# EAGLE design line+kick (EAGLE 9.4.0)
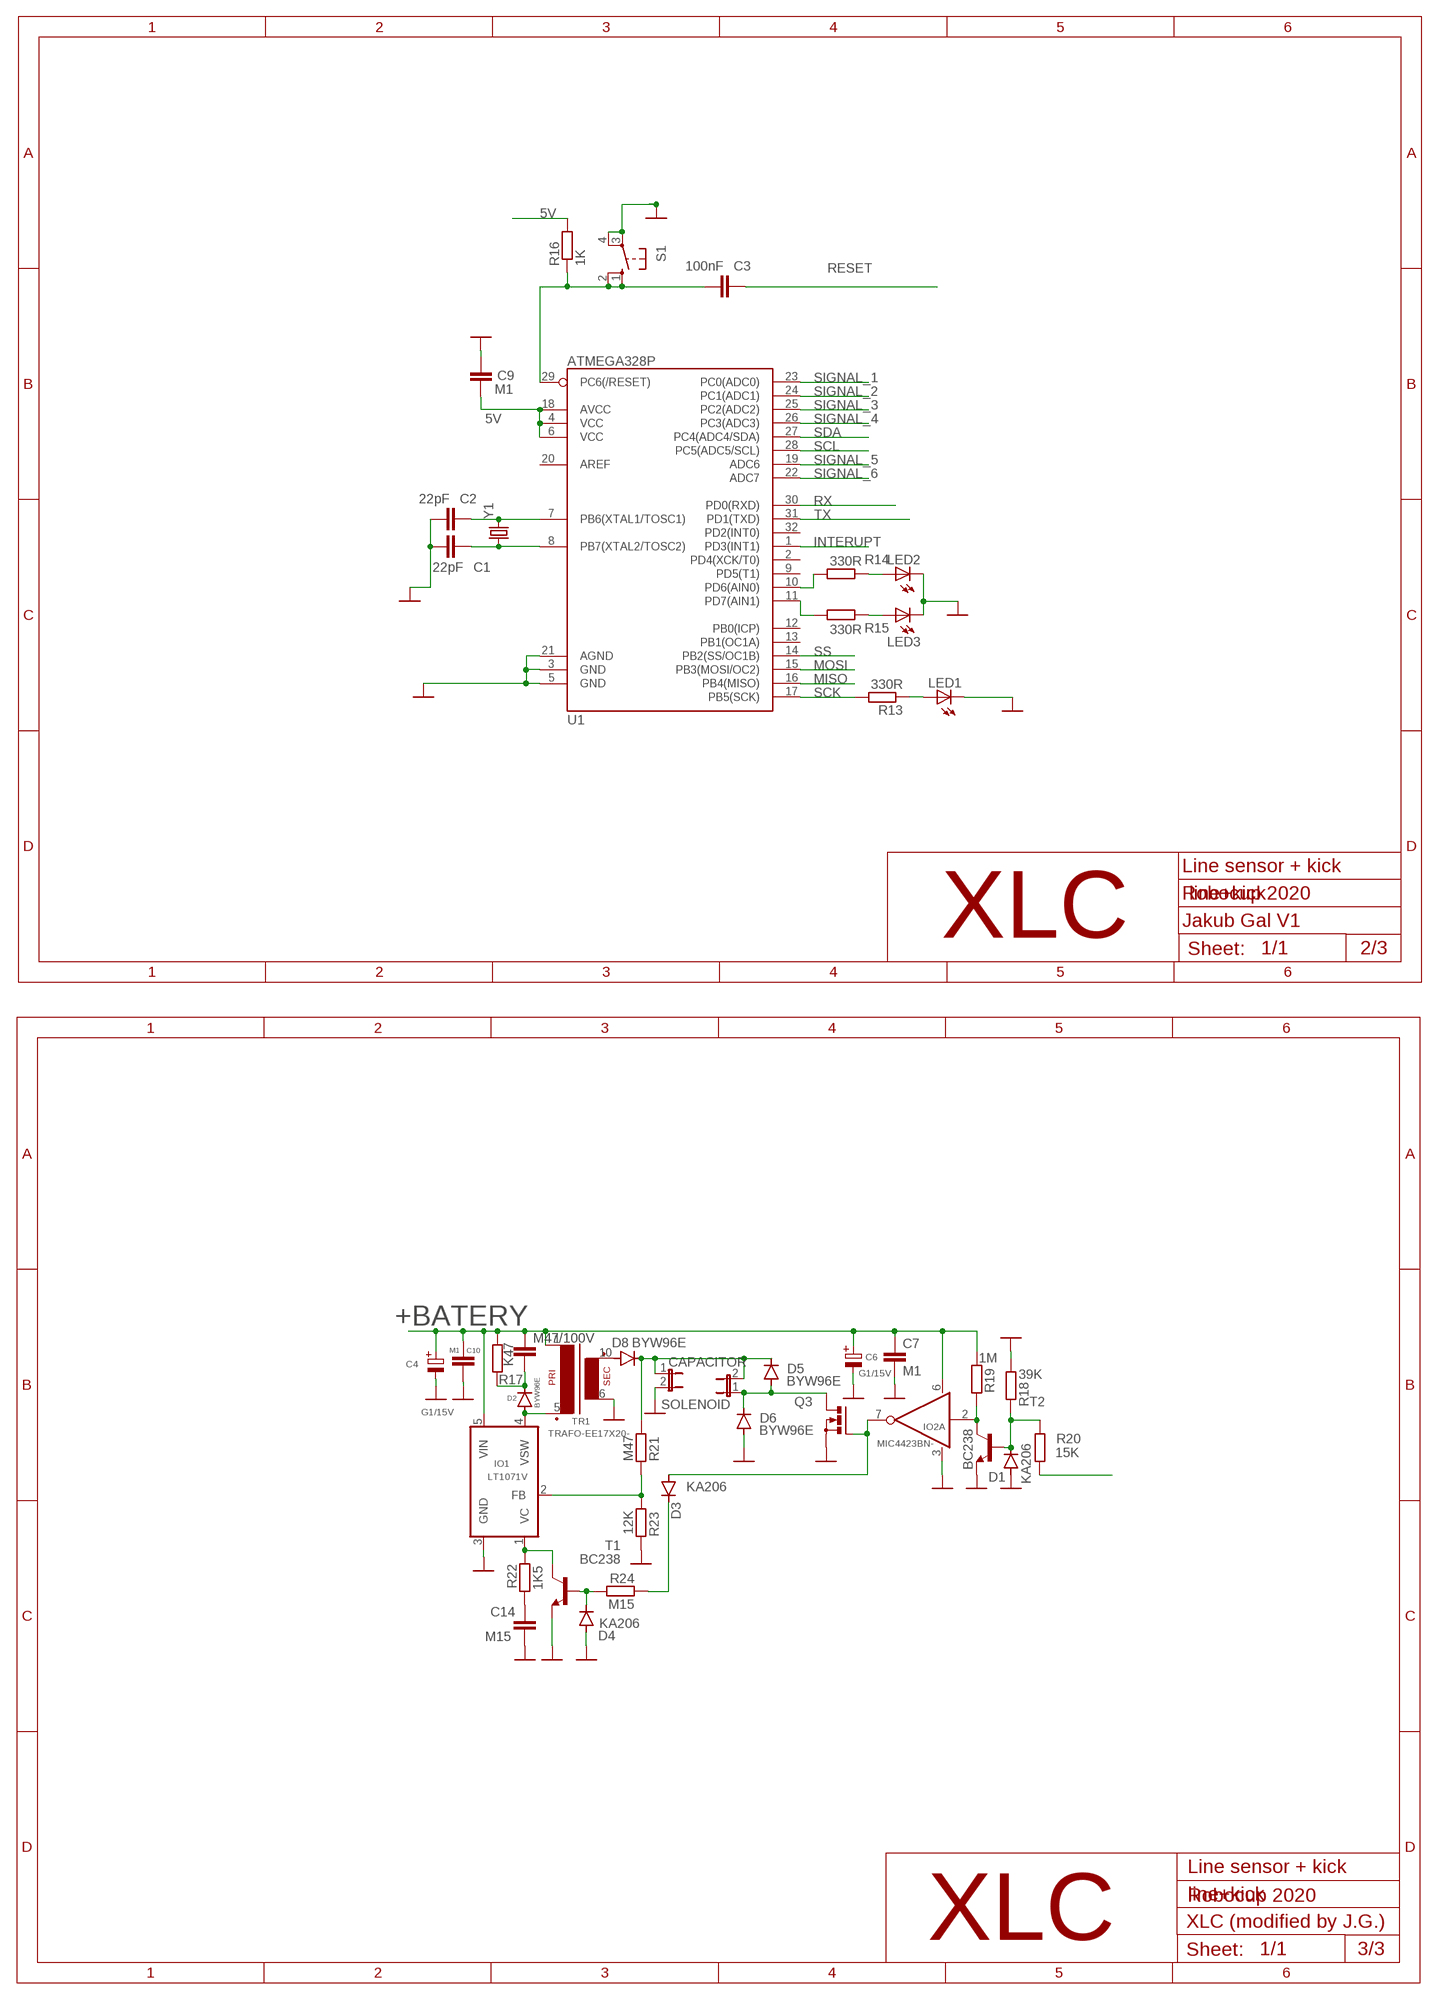
[diagram p0: schematic, sheet 1, part 1 of 2]
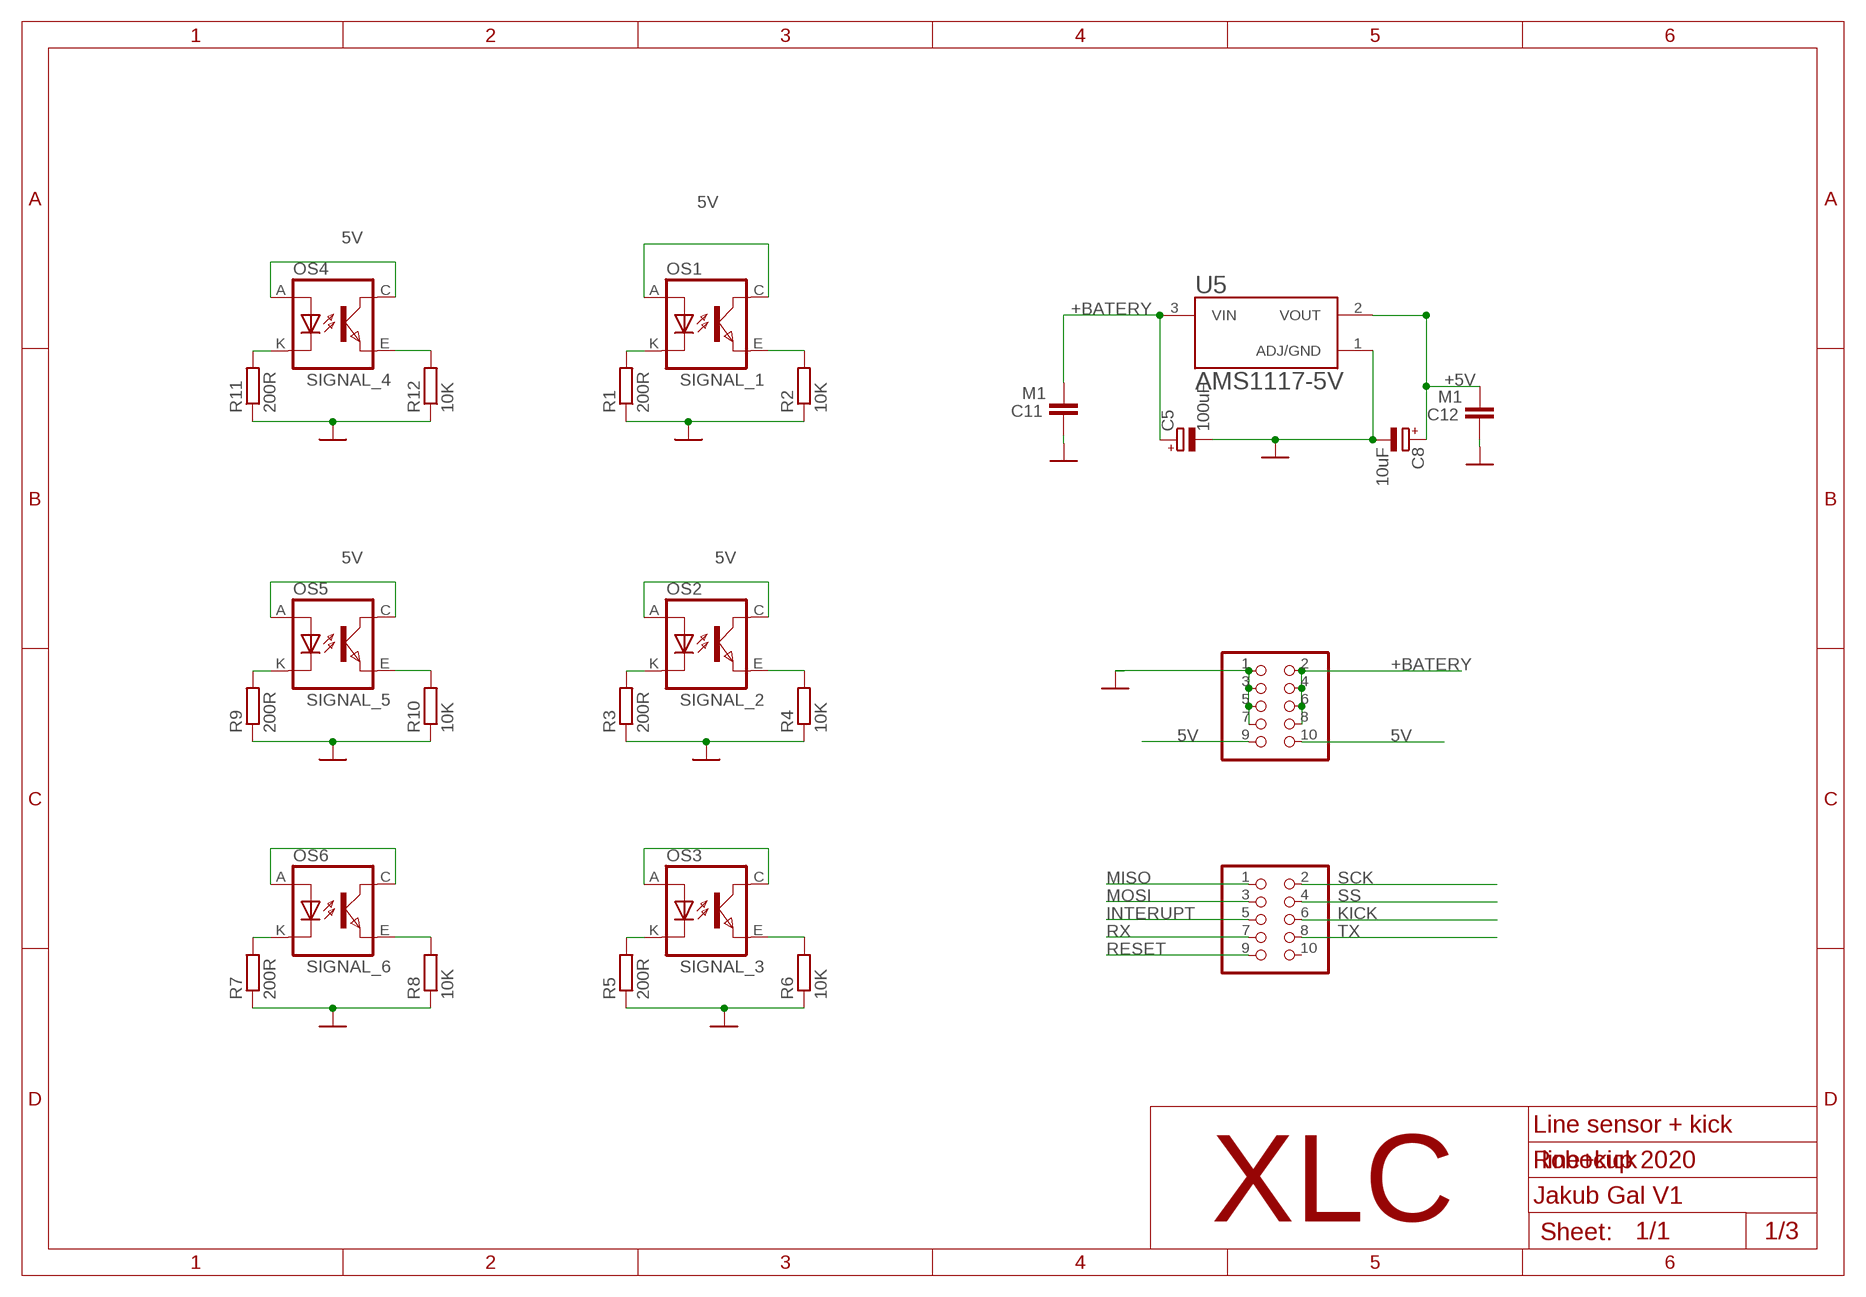
[diagram p1: schematic, sheet 1, part 2 of 2]

## Parts
C1  22pF  C-EUC0603  [C0603]
C2  22pF  C-EUC0603  [C0603]
C3  100nF  C-EUC0603  [C0603]
C4  G1/15V  KOND-ELEKT-2,5/7  [E-2,5/7-RAD]
C5  100uF  CPOL-EUUD-6,3X7,7  [UD-6,3X7,7_NICHICON]
C6  G1/15V  KOND-ELEKT-2,5/7  [E-2,5/7-RAD]
C7  M1  C-EUC0805K  [C0805K]
C8  10uF  CPOL-EUUD-4X5,8  [UD-4X5,8_NICHICON]
C9  M1  C-EUC0603  [C0603]
C10  M1  C-EUC0805K  [C0805K]
C11  M1  C-EUC0603  [C0603]
C12  M1  C-EUC0603  [C0603]
C14  M15  C-EUC0805K  [C0805K]
CAPACITOR  JP1E  [JP1]
D1  KA206  DIODE-D-7.5  [D-7.5]
D2  BYW96E  BYW96  [SOD64-10]
D3  KA206  DIODE-D-7.5  [D-7.5]
D4  KA206  DIODE-D-7.5  [D-7.5]
D5  BYW96E  BYW96  [SOD64-10]
D6  BYW96E  BYW96  [SOD64-10]
D8  BYW96E  BYW96  [SOD64-10]
IO1  LT1071V  [TO-220-5P]
IO2  MIC4423BN-  [DIL8]
JP2  PINHD-2X5  [2X05]
JP3  PINHD-2X5  [2X05]
LED1  LEDCHIPLED_0603  [CHIPLED_0603]
LED2  LEDCHIPLED_0603  [CHIPLED_0603]
LED3  LEDCHIPLED_0603  [CHIPLED_0603]
M47/100V  C-EUC0805K  [C0805K]
OS1  TCRT5000  [TCRT5000]
OS2  TCRT5000  [TCRT5000]
OS3  TCRT5000  [TCRT5000]
OS4  TCRT5000  [TCRT5000]
OS5  TCRT5000  [TCRT5000]
OS6  TCRT5000  [TCRT5000]
Q3  PMOSFET_NTO220BV  [TO220BV]
R1  200R  R-EU_R0603  [R0603]
R2  10K  R-EU_R0603  [R0603]
R3  200R  R-EU_R0603  [R0603]
R4  10K  R-EU_R0603  [R0603]
R5  200R  R-EU_R0603  [R0603]
R6  10K  R-EU_R0603  [R0603]
R7  200R  R-EU_R0603  [R0603]
R8  10K  R-EU_R0603  [R0603]
R9  200R  R-EU_R0603  [R0603]
R10  10K  R-EU_R0603  [R0603]
R11  200R  R-EU_R0603  [R0603]
R12  10K  R-EU_R0603  [R0603]
R13  330R  R-EU_R0603  [R0603]
R14  330R  R-EU_R0603  [R0603]
R15  330R  R-EU_R0603  [R0603]
R16  1K  R-EU_R0603  [R0603]
R17  K47  R-EU_R0603  [R0603]
R18  39K  R-EU_R0603  [R0603]
R19  1M  R-EU_R0603  [R0603]
R20  15K  R-EU_R0603  [R0603]
R21  M47  R-EU_R0603  [R0603]
R22  1K5  R-EU_R0603  [R0603]
R23  12K  R-EU_R0603  [R0603]
R24  M15  R-EU_R0603  [R0603]
S1  10-XX  [B3F-10XX]
SOLENOID  JP1E  [JP1]
T1  BC238  [TO92]
T2  BC238  [TO92]
TR1  TRAFO-EE17X20-  [TRAFO-EE17X20]
U1  ATMEGA328P  ATMEGA328_SMT  [TQFP32-08]
U5  AMS1117-5V  AMS1117-3.3  [SOT229P700X180-4N]
Y1  CRYSTALHC49US  [HC49US]

## Nets
5V: C9.1 JP3.9 JP3.10 OS1.A(ANODE) OS1.C(COLLECTOR) OS2.A(ANODE) OS2.C(COLLECTOR) OS3.A(ANODE) OS3.C(COLLECTOR) OS4.A(ANODE) OS4.C(COLLECTOR) OS5.A(ANODE) OS5.C(COLLECTOR) OS6.A(ANODE) OS6.C(COLLECTOR) R16.2 U1.4(VCC) U1.6(VCC) U1.18(AVCC)
+5V: C8.+ C12.1 U5.2(VOUT)
+BATERY: C4.+ C5.+ C6.+ C7.1 C10.1 C11.1 IO1.5(VIN) IO2.6(G:VCC) JP3.2 JP3.4 JP3.6 JP3.8 M47/100V.1 R17.1 R19.2 TR1.1 U5.3(VIN)
GND: C1.1 C2.1 C4.- C5.- C6.- C7.2 C8.- C9.2 C10.2 C11.2 C12.2 C14.2 CAPACITOR.2 D1.A D4.A D6.A IO1.3(GND) IO2.3(G:GND) JP3.1 JP3.3 JP3.5 JP3.7 LED1.C LED2.C LED3.C Q3.S R1.1 R2.1 R3.1 R4.1 R5.1 R6.1 R7.1 R8.1 R9.1 R10.1 R11.1 R12.1 R18.2 R23.1 S1.3(P) S1.4(P1) T1.1(E) T2.1(E) TR1.6 U1.3(GND) U1.5(GND) U1.21(AGND) U5.1(ADJ/GND)
INTERUPT: JP2.5 U1.1(PD3(INT1))
KICK: JP2.6 R20.1
MISO: JP2.1 U1.16(PB4(MISO))
MOSI: JP2.3 U1.15(PB3(MOSI/OC2))
N$1: OS1.K(CATHODE) R1.2
N$2: OS2.K(CATHODE) R3.2
N$3: OS3.K(CATHODE) R5.2
N$4: OS6.K(CATHODE) R7.2
N$5: OS5.K(CATHODE) R9.2
N$6: OS4.K(CATHODE) R11.2
N$7: C2.2 U1.7(PB6(XTAL1/TOSC1)) Y1.2
N$8: C1.2 U1.8(PB7(XTAL2/TOSC2)) Y1.1
N$9: IO1.1(VC) R22.1 T1.3(C)
N$10: C14.1 R22.2
N$11: D8.A TR1.10
N$13: CAPACITOR.1 D5.C D8.C R21.2 SOLENOID.2
N$14: IO1.2(FB) R21.1 R23.2
N$15: D4.C R24.2 T1.2(B)
N$16: C3.1 R16.1 S1.1(S) S1.2(S1) U1.29(PC6(/RESET))
N$17: LED1.A R13.1
N$18: IO2.2(A:I) R19.1 T2.3(C)
N$19: LED2.A R14.1
N$20: R15.2 U1.11(PD7(AIN1))
N$21: LED3.A R15.1
N$22: R14.2 U1.10(PD6(AIN0))
N$23: D2.A IO1.4(VSW) TR1.5
N$24: D2.C M47/100V.2 R17.2
N$25: D3.A IO2.7(A:O) Q3.G
N$26: D5.A D6.C Q3.D SOLENOID.1
N$29: D3.C R24.1
N$31: D1.C R18.1 R20.2 T2.2(B)
RESET: C3.2 JP2.9
RX: JP2.7 U1.30(PD0(RXD))
SCK: JP2.2 R13.2 U1.17(PB5(SCK))
SCL: U1.28(PC5(ADC5/SCL))
SDA: U1.27(PC4(ADC4/SDA))
SIGNAL_1: OS1.E(EMITTER) R2.2 U1.23(PC0(ADC0))
SIGNAL_2: OS2.E(EMITTER) R4.2 U1.24(PC1(ADC1))
SIGNAL_3: OS3.E(EMITTER) R6.2 U1.25(PC2(ADC2))
SIGNAL_4: OS4.E(EMITTER) R12.2 U1.26(PC3(ADC3))
SIGNAL_5: OS5.E(EMITTER) R10.2 U1.19(ADC6)
SIGNAL_6: OS6.E(EMITTER) R8.2 U1.22(ADC7)
SS: JP2.4 U1.14(PB2(SS/OC1B))
TX: JP2.8 U1.31(PD1(TXD))
Unconnected: IO2.4(B:I) IO2.5(B:O) JP2.10 U1.2(PD4(XCK/T0)) U1.9(PD5(T1)) U1.12(PB0(ICP)) U1.13(PB1(OC1A)) U1.20(AREF) U1.32(PD2(INT0))

## Notes on the sheet
- Line sensor + kick
- Robocup 2020
- Jakub Gal V1
- XLC
- 2/3
- Line sensor + kick
- Robocup 2020
- XLC (modified by J.G.)
- XLC
- 3/3
- Line sensor + kick
- Robocup 2020
- Jakub Gal V1
- XLC
- 1/3

## Library data of the parts
C1-C3 C9 C11 C12 = rcl:C-EU: CAPACITOR, European symbol
C4 C6 = TABOR K1:KOND-ELEKT: Kondenzátor elektrolyticky
C5 C8 = rcl:CPOL-EU: POLARIZED CAPACITOR, European symbol; SPICEPREFIX: C
C7 C10 C14 M47/100V = resistor:C-EU: CAPACITOR, European symbol
CAPACITOR SOLENOID = jumper:JP1E: JUMPER
D1 D3 D4 = diode:DIODE-: DIODE
D2 D5 D6 D8 = diode:BYW96: DIODE fast soft-recovery rectifier
IO1 = TABOR K1:LT1071: DC/DC pulzný IO
IO2 = TABOR K1:MIC4423BN: Dvojity invertor - budic FET tranzistorov
JP2 JP3 = pinhead:PINHD-2X5: PIN HEADER
LED1-LED3 = audio amplifier example:LED
OS1-OS3 OS5 = tcrt5000:TCRT5000
OS4 OS6 = tcrt5000:TCRT5000; SPICEPREFIX: O
Q3 = transistor-power:PMOSFET_N: Power MOSFET N-Channel
R1-R16 = rcl:R-EU_: RESISTOR, European symbol; SPICEPREFIX: R
R17-R24 = resistor:R-EU_: RESISTOR, European symbol
S1 = switch-omron:10-XX: OMRON SWITCH; MPN: B3F-1000; OC_FARNELL: 176432; OC_NEWARK: 36M3542
T1 T2 = transistor:BC238: NPN TRANSISTOR
TR1 = TABOR K1:TRAFO-EE17X20: Trafo na ferite EE17x20 - 1 primar, 1 sekundar
U1 = SparkFun-DigitalIC:ATMEGA328_SMT: 32-Pin Atmega328 part Commonly used on Arduino compatible boards Available in QFP and QFN packages TQFP is IC-09069 QFN is non-stock; PROD_ID: IC-09069
U5 = AMS1117-3.3:AMS1117-3.3: Sot223/Pkg 1-Amp 3.3-Volt Low Drop Out Voltage Regulatator; AVAILABILITY: Unavailable; DESCRIPTION: Sot223/Pkg 1-Amp 3.3-Volt Low Drop Out Voltage Regulatator; MF: Advanced Monolithic Systems; MP: AMS1117-3.3; PACKAGE: None; PRICE: None
Y1 = SparkFun-FreqCtrl:CRYSTAL: Various standard crystals. Proven footprints. Spark Fun Electronics SKU : COM-00534

## Board
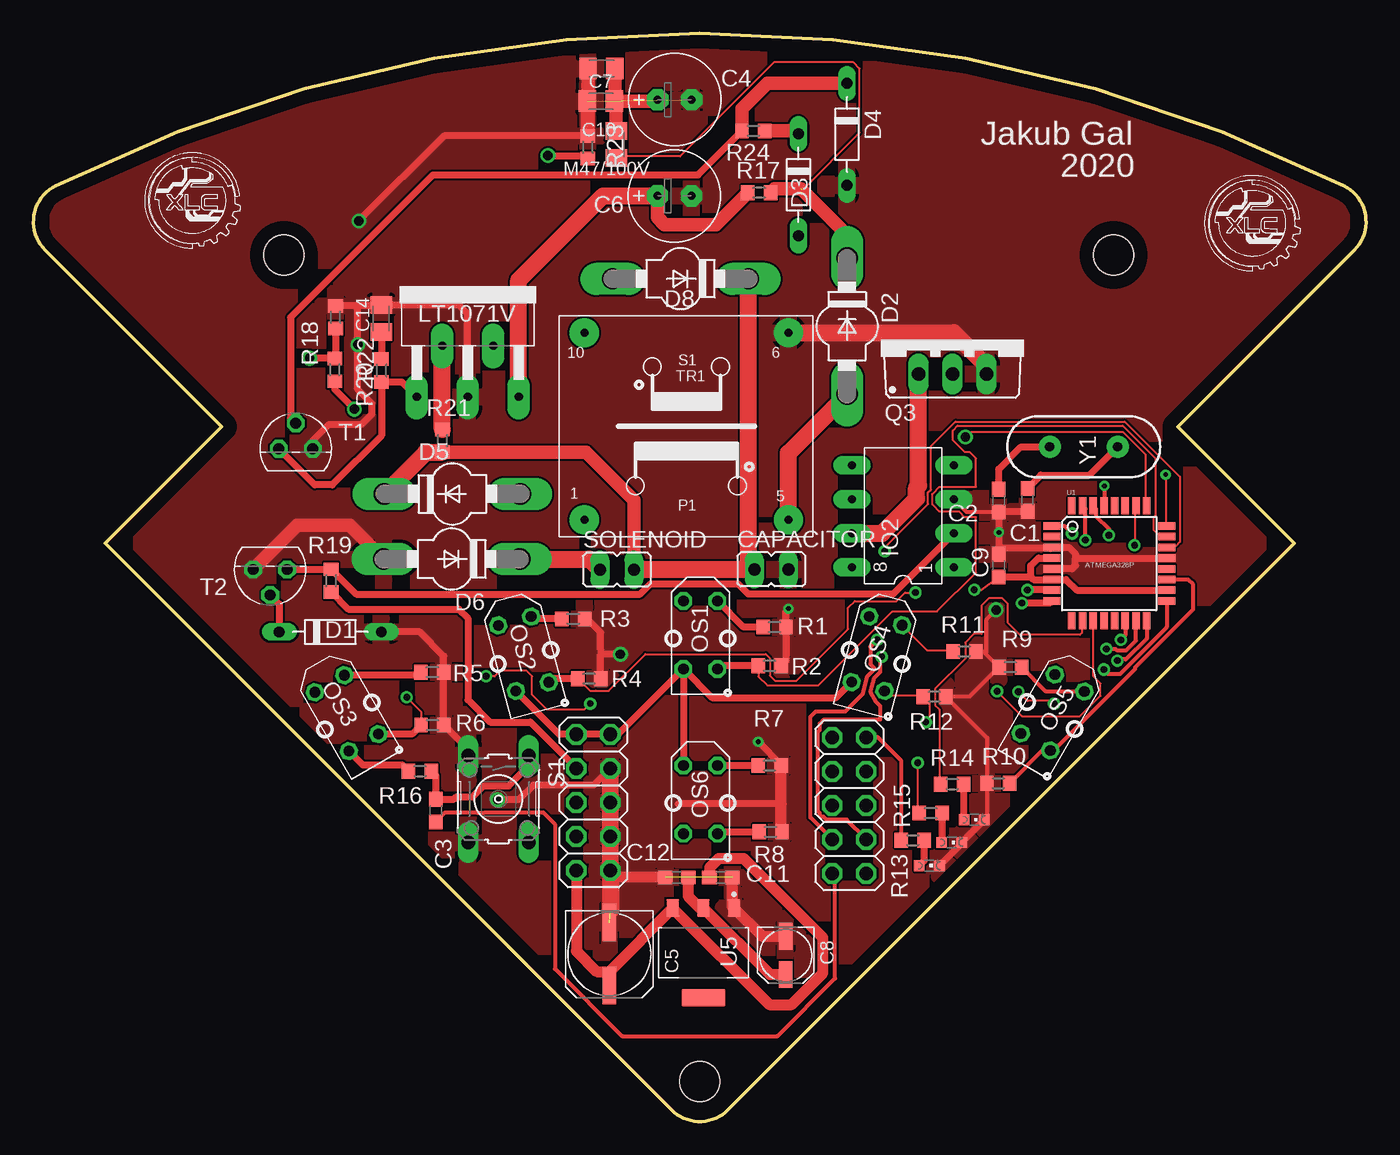
[diagram p2: board, top side]
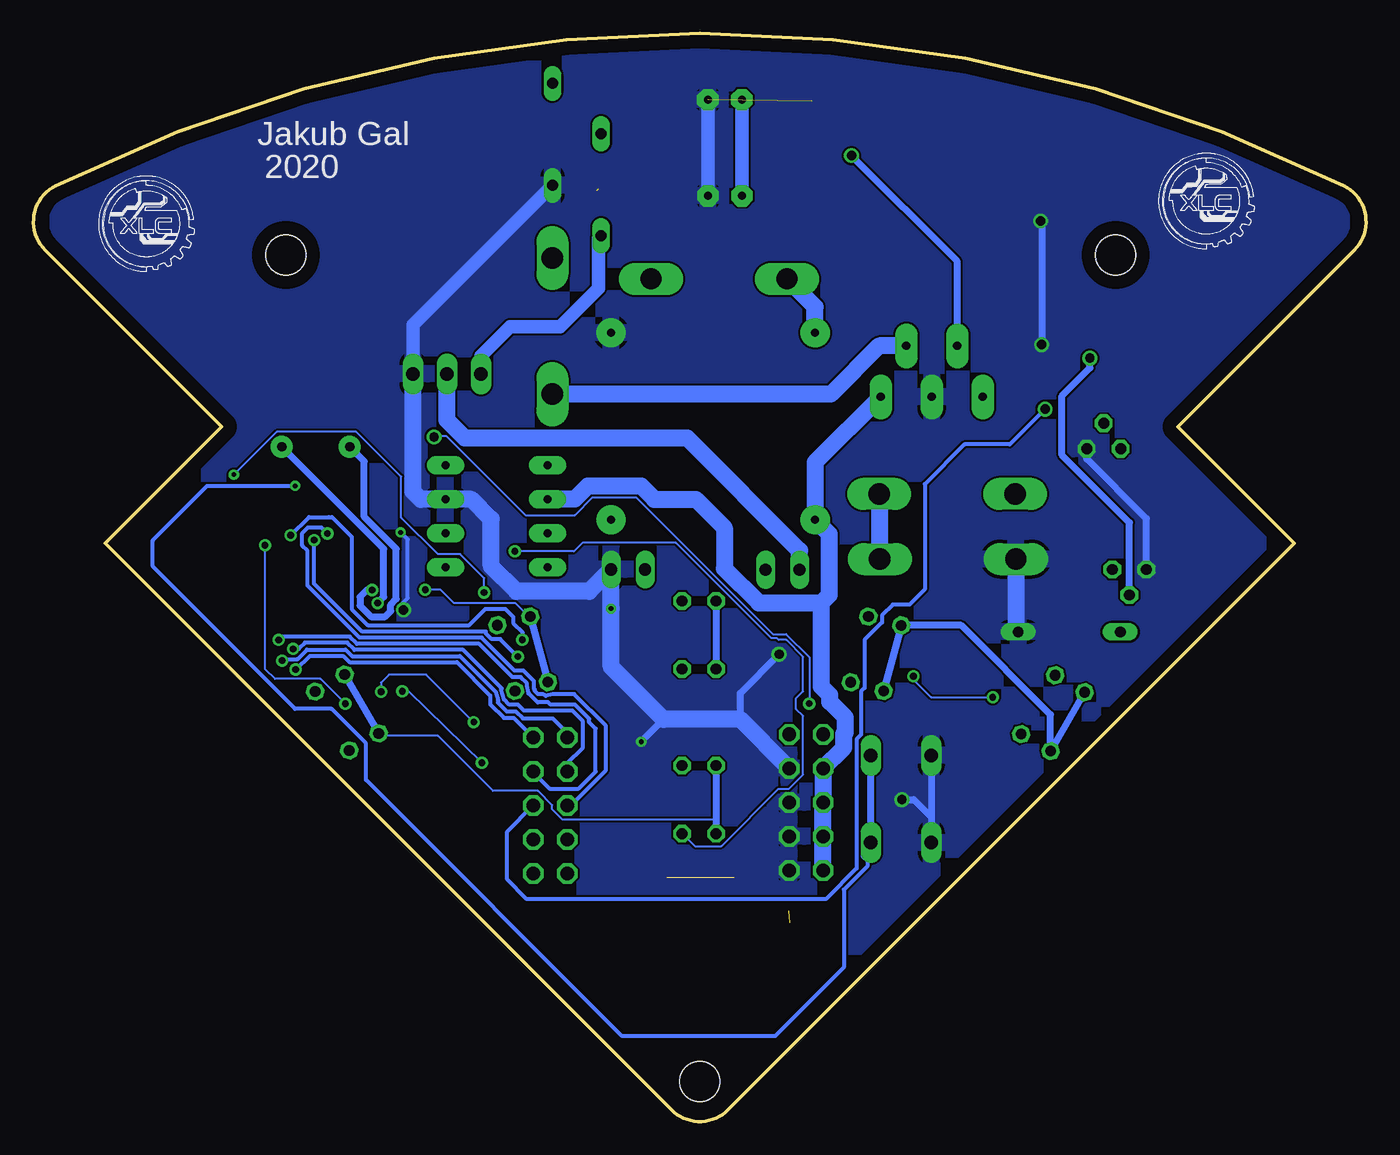
[diagram p3: board, bottom side, seen from below]

Size 99.55 x 81.25 mm. Coordinates in mm from the lower left corner, seen from the top.
Outline: 85.49,51.89 98.67,65.08 arc108 97.9,69.88 arc53 1.66,69.88 arc108 0.88,65.08 14.07,51.89 5.35,43.18 47.66,0.87 arc90 51.9,0.87 94.2,43.18 85.49,51.89
Copper layers (1*16): Top 0.035mm / dielectric 1.5mm / Bottom 0.035mm
Design rules "default": minimum track width 6mil, minimum drill 0.35mm, track to track 6mil, track to pad 6mil, pad to pad 6mil, via to via 6mil, smd to smd 6mil, copper to edge 40mil, drill to drill 6mil, minimum pad ring 10mil, minimum via ring 8mil, stop-mask expansion 4mil, vias tented up to drill 0mil, thermal gap 10mil
Holes 3 mm at 49.78,3 18.71,64.71 80.71,64.71

### Footprints (pad centres in the part's own frame; a part is rotated, then mirrored left to right if it is on the bottom)
C0603 = smd 1.1 x 1: 1 -0.85,0; 2 0.85,0
E-2,5/7-RAD = drill 0.61 pad 1.6 octagon: + -1.27,0; - 1.27,0
UD-6,3X7,7_NICHICON = smd 2.8 x 1: + 2.35,0; - -2.35,0
C0805K = smd 1.3 x 1.6: 1 -1,0; 2 1,0
UD-4X5,8_NICHICON = smd 2 x 1: + 1.425,0; - -1.425,0
JP1 = drill 0.914 long: 1 0,-1.27; 2 0,1.27
D-7.5 = drill 0.813 long: A 3.81,0; C -3.81,0
SOD64-10 = drill 1.6 long: A 5.08,0; C -5.08,0
TO-220-5P = drill 0.61 pad 1.676 long: 1 -3.81,0; 2 -1.905,3.81; 3 0,0; 4 1.905,3.81; 5 3.81,0
DIL8 = drill 0.61 pad 1.4 long: 1 -3.81,-3.81; 2 -1.27,-3.81; 3 1.27,-3.81; 4 3.81,-3.81; 5 3.81,3.81; 6 1.27,3.81; 7 -1.27,3.81; 8 -3.81,3.81
2X05 = drill 1.016 octagon: 1 -5.08,-1.27; 2 -5.08,1.27; 3 -2.54,-1.27; 4 -2.54,1.27; 5 0,-1.27; 6 0,1.27; 7 2.54,-1.27; 8 2.54,1.27; 9 5.08,-1.27; 10 5.08,1.27
CHIPLED_0603 = smd 0.8 x 0.8: A 0,-0.75; C 0,0.75
TCRT5000 = drill 0.8 octagon: A -2.54,-1.27; C 2.54,-1.27; E 2.54,1.27; K -2.54,1.27
TO220BV = drill 1.016 long: D 0,-2.54; G -2.54,-2.54; S 2.54,-2.54
R0603 = smd 1 x 1.1: 1 -0.85,0; 2 0.85,0
B3F-10XX = drill 1.016 long: 1 -3.251,2.261; 2 3.251,2.261; 3 -3.251,-2.261; 4 3.251,-2.261
TO92 = drill 0.813 octagon: 1 1.27,0; 2 0,1.905; 3 -1.27,0
TRAFO-EE17X20 = drill 0.61 pad 2.184: 1 -7.62,-7.62; 5 7.62,-7.62; 6 7.62,6.35; 10 -7.62,6.35
TQFP32-08 = smd 1.27 x 0.559: 1 -4.293,2.8; 2 -4.293,2; 3 -4.293,1.2; 4 -4.293,0.4; 5 -4.293,-0.4; 6 -4.293,-1.2; 7 -4.293,-2; 8 -4.293,-2.8; 17 4.293,-2.8; 18 4.293,-2; 19 4.293,-1.2; 20 4.293,-0.4; 21 4.293,0.4; 22 4.293,1.2; 23 4.293,2; 24 4.293,2.8 | smd 0.559 x 1.27: 9 -2.8,-4.293; 10 -2,-4.293; 11 -1.2,-4.293; 12 -0.4,-4.293; 13 0.4,-4.293; 14 1.2,-4.293; 15 2,-4.293; 16 2.8,-4.293; 25 2.8,4.293; 26 2,4.293; 27 1.2,4.293; 28 0.4,4.293; 29 -0.4,4.293; 30 -1.2,4.293; 31 -2,4.293; 32 -2.8,4.293
SOT229P700X180-4N = smd 0.93 x 1.31: 1 -2.29,-3.345; 2 0,-3.345; 3 2.29,-3.345 | smd 3.24 x 1.31: 4 0,3.345
HC49US = drill 0.7 pad 1.651: 1 -2.54,0; 2 2.54,0

### Placement (x,y rotation side)
C1  74.26,46.42 90 top
C2  72.12,46.37 90 top
C3  30.05,23.22 270 top
C4  47.9,76.31 0 top
C5  43.02,12.5 270 top
C6  47.89,69.13 0 top
C7  42.38,76.21 180 top
C8  56.2,12.41 270 top
C9  72.11,41.52 90 top
C10  42.43,78.64 180 top
C11  51.36,18.23 0 top
C12  48.06,18.24 180 top
C14  25.98,59.97 90 top
CAPACITOR  55.13,41.23 270 top
D1  22.18,36.56 0 top
D2  60.78,59.4 270 top
D3  57.15,69.96 270 top
D4  60.78,73.72 270 top
D5  31.3,46.88 0 top
D6  31.24,42 180 top
D8  48.34,62.94 180 top
IO1  32.45,54.12 0 top
IO2  64.96,45.2 90 top
JP2  60.95,23.61 270 top
JP3  41.83,23.84 90 top
LED1  66.93,19.11 270 top
LED2  70.28,22.54 270 top
LED3  68.6,20.84 270 top
M47/100V  43.53,72.97 270 top
OS1  49.83,36.34 270 top
OS2  36.61,34.93 285 top
OS3  23.4,30.5 300 top
OS4  63.01,34.94 255 top
OS5  76.13,30.54 240 top
OS6  49.83,24.04 270 top
Q3  68.66,58.37 0 top
R1  55.37,36.93 180 top
R2  55,34.04 180 top
R3  40.33,37.54 180 top
R4  41.52,33.07 180 top
R5  29.8,33.56 180 top
R6  29.81,29.61 180 top
R7  55,26.58 180 top
R8  55.07,21.64 180 top
R9  72.98,33.93 0 top
R10  72.08,25.26 0 top
R11  69.56,35.11 180 top
R12  67.32,31.73 180 top
R13  65.69,21 180 top
R14  68.64,25.19 180 top
R15  67.03,23.04 180 top
R16  28.87,26.16 180 top
R17  54.22,69.37 0 top
R18  22.57,60.07 90 top
R19  22.24,40.4 270 top
R20  22.51,56.14 90 top
R21  30.55,50.84 270 top
R22  26,56.09 90 top
R23  41.42,72.76 270 top
R24  53.78,73.98 180 top
S1  34.74,24.09 270 top
SOLENOID  43.59,41.21 270 top
T1  19.6,50.24 0 top
T2  17.68,41.23 180 top
TR1  48.78,52.56 0 top
U1  80.37,41.68 0 top
U5  50.05,12.6 180 top
Y1  78.46,50.39 180 top

### Tracks (layer width: path | path; a pad name or v marks a point on that pad's centre or on a via)
5V  (via drill 0.5)
  Top 0.152: v70.28,39.7 70.81,39.7 C9.1
  Top 0.508: OS4.C 59.97,31.66 50.7,31.66 OS1.C | OS1.C OS6.A | OS1.C 43.68,28.92 JP3.9 JP3.10 39.27,28.92 OS2.C | OS3.C 24.6,26.63 27.55,26.63 R16.2 | C9.1 74.51,40.67 | 74.51,40.67 74.71,40.46 76.06,40.46 U1.6 77.13,40.48 77.93,39.68 U1.18 | 74.51,40.67 74.51,41.51 75.08,42.08 U1.4
  Bottom 0.152: v70.28,39.7 69.12,39.7 68.12,38.71 63.55,38.71 62.63,37.79 OS4.A | 48.56,22.55 60.04,22.55 60.81,23.31 60.81,23.62 61.87,24.69 65.23,24.69 69.34,28.8 73.61,28.8 OS5.C
  Bottom 0.508: OS6.A 48.56,22.55 OS6.C | OS4.A OS4.C | OS1.A OS1.C | OS2.C OS2.A 30.24,37.05 23.57,30.38 OS3.C OS3.A | OS5.A OS5.C
+5V
  Top 0.813: C12.1 48.91,16.83 49.79,15.94 U5.2 55.01,10.98 C8.+
+BATERY
  Top 0.508: R19.2 23.52,38.27 31.77,38.27 32.45,37.58 32.45,31.48 34.12,29.82 37.12,29.82 JP3.8
  Top 0.813: 43.02,11.2 C5.+ | 43.02,11.2 U5.3 54.97,8.73 | JP3.2 40.56,12.73 42.08,11.2 43.02,11.2 | 54.97,8.73 | C11.1 50.51,18.96 51.19,19.64 53.08,19.64 58.98,13.74 58.98,11.08 56.63,8.73 54.97,8.73
  Top 1.016: C4.+ 46.53,76.21 C7.1 | C7.1 43.53,76.06 M47/100V.1 | C10.1 43.43,76.26 C7.1 | R17.1 50.99,66.99 47.16,66.99 46.62,67.53 C6.+
  Top 1.27: IO1.5 36.26,62.83 42.56,69.13 C6.+
  Bottom 1.016: C4.+ C6.+
  Bottom 1.27: JP3.2 JP3.4 JP3.6 JP3.8 39.01,27.93 39.01,28.93 38.9,29.04 38.9,30.18 40.06,31.34 40.06,31.84 40.69,32.47 40.69,38.73 | IO1.5 41.16,49.22 TR1.1 40.09,43.87 40.09,39.33 40.69,38.73 | IO2.6 61.12,46.5 59.1,46.5 58.13,47.47 54.16,47.47 53.16,46.47 50.07,46.47 47.93,44.33 47.93,41.29 45.37,38.73 40.69,38.73
GND  (via drill 0.35, 0.7)  (3 unrouted)
  Top 0.152: 20.88,50.29 T1.1 20.88,50.29
  Top 0.305: 71.03,22.52 71.23,22.72 R10.1 71.23,28.67 R12.1 69.93,31.73 R9.1 71.2,34.86 | R11.1 70.95,35.11 71.2,34.86 | C2.1 69.72,45.52 IO2.3 | 71.2,34.86 71.2,37.5 v71.91,38.21
  Top 0.508: 55.85,23.73 48.19,23.73 | LED2.C 71.03,22.52 LED3.C 69.35,20.78 LED1.C | C1.1 72.17,45.57 C2.1 v72.12,44 72.12,42.81 | S1.3 32.48,27.79 R6.1 R5.1 30.65,34.76 28.85,36.56 D1.A | 72.12,42.81 C9.2 | 77.85,42.06 77.85,42.4 77.37,42.88 U1.3 76.01,42.81 72.12,42.81 | 77.85,42.06 77.85,41.53 77.6,41.28 U1.5 | 24.15,60.92 25.93,60.92 C14.2 31.8,60.97 32.45,60.32 IO1.3 | 24.15,60.92 R18.2 | T1.1 20.87,50.86 22.07,52.06 24.5,52.06 25.29,52.85 25.29,53.61 24.23,54.68 v24.23,58.02 24.23,60.84 24.15,60.92 | R4.1 42.37,34.9 v43.85,34.9 | 42.37,35.23 42.37,36.53 41.36,37.54 R3.1 | R2.1 56.22,34.41 R1.1 56.22,38.13 v56.4,38.31 | v54.15,28.36 55.85,26.66 R7.1 | JP3.7 41.85,25.13 37.35,25.13 36.26,24.04 v34.67,24.04 | R23.1 30.66,73.61 v24.31,67.26 | 77.85,42.06 77.87,42.08 U1.21
  Top 0.813: C11.2 52.21,16.07 U5.1 54.45,13.83 C8.- | C12.2 43.62,18.24 JP3.1 | R8.1 55.85,21.71 55.85,23.73 R7.1
  Top 1.016: C7.2 41.38,73.65 R23.1 C10.2 | D6.A 23.63,44.53 19.71,44.53 T2.1
  Top 1.27: JP3.7 JP3.5 JP3.3 JP3.1 43.1,15.74 | TR1.6 68.75,58.91 71.2,56.46 Q3.S
  Bottom 0.305: v71.91,38.21 71.91,38.77 71.6,39.08 71.6,43.48 v72.12,44
  Bottom 0.508: S1.3 S1.4 32.48,22.73 33.79,24.04 v34.67,24.04 | T2.1 16.41,45.03 20.87,49.49 T1.1 | 46.75,30.03 46.75,32 v43.85,34.9 | 52.48,30.03 v54.15,28.36 | v24.31,67.26 24.23,67.18 v24.23,58.02
  Bottom 1.016: C6.- C4.- | D4.A 71.2,59.49 Q3.S
  Bottom 1.27: Q3.S 71.2,47.05 70.62,46.47 IO2.3 66.83,46.47 65.35,44.99 65.35,41.47 63.47,39.59 58.04,39.59 CAPACITOR.2 v56.4,38.31 56.4,33.95 52.48,30.03 46.75,30.03 JP3.7 | D6.A 26.16,36.73 D1.A
  pour Top: -9,-2 109,-2 109,87 -9,87
  pour Bottom: 111,92 111,-3 -11,-3 -11,92
INTERUPT  (via drill 0.5)
  Top 0.305: v77.6,43.92 77.05,44.47 U1.1
  Bottom 0.305: JP2.5 59.41,23.61 56.78,26.24 56.78,29.54 59.16,31.92 60.76,31.92 61.26,31.78 61.49,31.92 61.86,31.92 62.11,32.17 62.11,32.27 62.16,32.32 62.16,32.88 62.95,33.67 63.62,33.67 66.07,36.13 75.19,36.13 79.08,40.02 79.08,42.61 79.47,43 79.47,43.94 79.04,44.37 78.05,44.37 v77.6,43.92
KICK  (via drill 0.7)
  Top 0.508: v23.98,53.2 22.51,54.67 R20.1
  Bottom 0.305: v23.98,53.2 26.61,50.57 30,50.57 32.97,47.6 32.97,39.74 34.1,38.61 35.36,38.61 36.16,37.81 36.16,37.27 37.46,35.97 37.46,32.38 37.72,32.12 37.72,28.89 38.07,28.54 38.07,18.9 40.35,16.62 62.7,16.62 64.17,18.09 64.17,21.66 JP2.6
MISO  (via drill 0.5)
  Top 0.305: v80.97,34.42 81.18,34.42 81.26,34.5 81.6,34.5 83.17,36.07 U1.16
  Bottom 0.305: JP2.1 59.68,29.03 60.76,30.11 62.99,30.11 63.52,30.63 64.21,30.63 64.86,31.29 64.86,31.46 65.03,32.1 67.69,34.76 75.76,34.76 76.23,35.23 79.12,35.23 79.82,34.53 80.86,34.53 v80.97,34.42
MOSI  (via drill 0.5)
  Top 0.305: U1.15 82.37,35.91 81.66,35.21 80.92,35.21 80.84,35.29 v80.15,35.29
  Bottom 0.305: JP2.3 59.68,26.75 58.5,27.93 58.5,29.89 59.29,30.68 62.92,30.68 63.36,31.13 64,31.13 64.4,31.52 64.61,32.29 64.58,32.34 67.45,35.21 75.57,35.21 76.11,35.76 79.27,35.76 79.74,35.29 v80.15,35.29
N$1
  Top 0.508: R1.2 53.05,36.93 OS1.K
N$2
  Top 0.508: R3.2 37.35,37.54 OS2.K
N$3
  Top 0.508: R5.2 28.72,33.33 OS3.K
N$4
  Top 0.508: R7.2 OS6.K
N$5
  Top 0.305: R9.2 75.65,32.11 OS5.K
N$6
  Top 0.152: R11.2 68.58,35.2 66.75,35.2 64.92,37.03 OS4.K
N$7  (via drill 0.5 pad 0.55)
  Top 0.508: C2.2 72.12,48.73 73.78,50.39 Y1.2 | U1.7 76.06,39.7 v74.25,39.7
  Bottom 0.508: Y1.2 74.84,49.31 74.84,45.16 72.45,42.77 72.45,39.03 72.87,38.6 72.87,38.11 73.27,37.71 74.34,37.71 75.16,38.53 75.16,39.18 74.64,39.7 v74.25,39.7
N$8  (via drill 0.5 pad 0.55)
  Top 0.508: C1.2 75.26,48.27 78.88,48.27 Y1.1 | U1.8 75.92,38.72 v73.84,38.72
  Bottom 0.508: v73.84,38.72 73.38,39.17 73.38,42.77 Y1.1
N$9
  Top 0.508: IO1.1 27.52,55.24 R22.1 26,51.23 22.32,47.55 21.02,47.55 T1.3
N$10
  Top 0.508: C14.1 26,58.95 R22.2
N$11
  Bottom 1.27: TR1.10 41.16,60.84 D8.A
N$13
  Top 1.016: SOLENOID.2 44.86,46.41 41.28,49.99 R21.2
  Top 1.27: D8.C 53.42,41.67 CAPACITOR.1 44.88,41.23 SOLENOID.2 | D5.C 29.33,49.99 R21.2
  Bottom 1.27: SOLENOID.2 44.88,41.23
N$14  (via drill 0.7)
  Top 0.508: v38.44,72.14 41.19,72.14 R23.2
  Top 1.27: R21.1 IO1.2
  Bottom 0.508: IO1.2 30.54,64.24 v38.44,72.14
N$15
  Top 0.508: T1.2 19.2,52.54 19.2,60.05 29.85,70.7 49.65,70.7 R24.2
  Top 1.016: D4.C 54.84,77.53 52.93,75.62 R24.2
N$16  (via drill 0.35)
  Top 0.305: v80,47.47 80,46 U1.29
  Top 0.508: S1.1 37,26.57 35.5,25.07 33.62,25.07 32.79,24.24 31.58,24.24 31.41,24.07 C3.1 30.05,25.83 R16.1
  Bottom 0.305: v80,47.47 86.58,47.47 90.64,43.41 90.64,41.45 80.01,30.82 77.28,30.82 74.71,28.25 74.71,25.52 55.57,6.38 44.15,6.38 39.01,11.52 39.01,17.31 37.26,19.06 37.26,19.47 37.61,19.82 37.61,20.23 S1.2
  Bottom 0.508: S1.2 S1.1
N$17
  Top 0.508: R13.1 66.54,19.47 LED1.A
N$18
  Top 0.508: T2.3 19.79,41.23 R19.1 24.11,39.38 45.32,39.38 46.1,40.16 52.64,40.16 53.4,39.4 64.24,39.4 IO2.2
N$19
  Top 0.508: R14.1 69.49,22.58 LED2.A
N$20  (via drill 0.5)
  Top 0.152: v66.05,26.8 66.05,23.16 R15.2 | 79.09,37.33 U1.11 79.17,33.27 79.71,32.73 79.71,31.79 78.19,30.27 73.85,30.27 v71.99,32.13
  Bottom 0.152: v71.99,32.13 71.51,32.13 v66.05,26.8
N$21
  Top 0.508: R15.1 67.88,20.87 LED3.A
N$22
  Top 0.152: R14.2 67.66,25.29 67.66,30.78 67.36,31.09 67.36,32.31 69.61,34.55 69.61,35.77 70.25,36.42 70.82,36.42 70.82,38.52 71.4,39.1 72.34,39.1 72.8,38.65 72.8,37.26 73.71,36.35 78.18,36.35 78.33,36.5 78.33,37.35 U1.10
N$23
  Top 0.152: 60.77,54.28 60.81,54.25 D2.A
  Top 1.27: TR1.5 56.4,49.91 60.77,54.28 61.16,54.67
  Bottom 1.27: IO1.4 36.38,57.93 39.99,54.32 D2.A
N$24  (1 unrouted)
  Top 0.152: 57.44,69.56 61.72,73.85 61.72,78.63 61.26,79.09 55.32,79.09 48.31,72.08 43.58,72.08 M47/100V.2
  Top 1.016: D2.C 60.78,66.23 57.44,69.56 | 57.35,69.66 55.36,69.66 R17.2
N$25
  Top 1.27: IO2.7 63.39,43.93 65.97,46.51 65.97,47.34 66.12,47.48 Q3.G
  Bottom 1.016: D3.A 57.34,65.96 57.34,62.23 60.23,59.34 63.96,59.34 66.12,57.18 Q3.G
N$26
  Top 1.27: D6.C 41.53,42 SOLENOID.1
  Bottom 1.27: D6.C 36.32,46.82 D5.A | SOLENOID.1 42.32,42.64 50.71,51.03 67.31,51.03 68.66,52.38 Q3.D
N$29
  Top 1.016: R24.1 56.94,73.98 D3.C
N$31  (via drill 0.7)
  Top 0.508: R18.1 22.57,57.05 | 22.57,57.05 R20.2 | T2.2 18.37,38.63 D1.C | v20.63,57.01 20.67,57.05 22.57,57.05
  Bottom 0.508: T2.2 17.68,44.72 22.72,49.76 22.72,54.2 20.63,56.29 v20.63,57.01
RESET
  Top 0.305: C3.2 30.77,23.09 33.12,23.09 33.14,23.07 33.7,23.07 33.71,23.09 38.08,23.09 38.96,22.21 38.96,11.4 43.98,6.38 55.57,6.38 59.88,10.69 59.88,18.33 JP2.9
  Top 0.508: 59.97,18.24 JP2.9
RX  (via drill 0.5)
  Top 0.305: JP2.7 58.04,22.71 58.04,30.23 58.45,30.64 60.66,30.64 61.95,31.93 62.31,33.25 62.8,33.74 62.8,33.87 62.52,34.15 62.52,35.47 v63.03,35.98 | U1.30 79.38,45.75 79.38,45.21 80.34,44.25 v80.34,43.78
  Bottom 0.305: v63.03,35.98 63.03,36.53 63.71,37.22 63.71,37.68 64.32,38.29 65.79,38.29 67,37.08 74.59,37.08 75.78,38.27 75.78,43.67 76.04,43.93 77.25,45.14 77.47,45.14 77.48,45.14 78.98,45.14 v80.34,43.78
SCK  (via drill 0.5)
  Top 0.305: R13.2 64.84,26.93 63.08,28.69 JP2.2 | U1.17 84.66,36.91 81.16,33.41 80.3,33.41 v79.96,33.76
  Bottom 0.305: JP2.2 63.68,30.14 64.41,30.14 65.42,31.16 65.42,31.8 67.92,34.3 75.95,34.3 76.42,34.78 78.9,34.78 79.92,33.76 v79.96,33.76
SIGNAL_1
  Top 0.152: U1.23 84.58,43.74 84.12,43.74 83.67,44.19 83.67,45.11 83.82,45.26 83.82,49.53 81.38,51.96 69.04,51.96 68.67,51.6 68.67,50.88 69.57,49.98 69.95,49.98 70.41,49.53 70.41,47.4 67.68,47.4 67.14,46.85 67.14,46.08 67.68,45.54 69.16,45.54 69.56,45.14 70.41,45.14 70.41,40.99 67.51,38.1 64.16,38.1 58.63,32.56 54.82,32.56 54.17,33.22 54.15,33.22 R2.2
  Top 0.508: R2.2 51.34,34.04 OS1.E
SIGNAL_2  (via drill 0.35, 0.5)
  Top 0.152: v84.58,48.31 84.58,44.5 U1.24 | v65.89,39.51 65.11,39.51 64.46,38.86 61.36,38.86 60.86,38.36 60.86,36.78 57,32.92 55.39,32.92 55.01,33.29 55.01,34.59 54.71,34.9 45.72,34.9 42.98,32.15 42.04,32.15 42,32.19 41.57,32.19 40.84,32.91 R4.2
  Top 0.508: R4.2 38.76,33.07 OS2.E
  Bottom 0.152: v84.58,48.31 81.38,51.51 75.44,51.51 72.08,48.15 72.08,45.11 69.34,42.36 67.66,42.36 65.89,40.59 v65.89,39.51
SIGNAL_3  (via drill 0.5, 0.7)
  Top 0.152: v69.62,51.13 69.69,51.13 70.07,51.51 81.38,51.51 83.06,49.83 83.06,46.02 U1.25 | 25.6,29.1 OS3.E | v41.6,31.21 41.15,30.76 38.37,30.76 37.26,31.87 37.26,33.24 36.83,33.67 34.88,33.67 34.46,33.25 v33.81,33.25 | v27.89,31.69 28.96,30.62 R6.2
  Top 0.508: R6.2 28.28,28.93 OS3.E
  Bottom 0.152: v69.62,51.13 69.54,51.21 68.73,51.21 62.8,45.28 59.1,45.28 57.77,46.61 54.52,46.61 44.31,36.4 43.32,36.4 41.6,34.68 v41.6,31.21 | v33.81,33.25 33.81,33.01 32.49,31.69 v27.89,31.69
SIGNAL_4  (via drill 0.5)
  Top 0.152: OS4.E 63.7,32.15 64.01,31.85 66.44,31.85 R12.2 66.6,31.7 66.94,31.35 66.94,30.11 v66.66,29.83 | v82.25,43.03 82.26,43.04 82.26,45.83 U1.26 | v76.25,31.19 76.02,31.42 74.25,31.42 v73.58,32.09
  Bottom 0.152: v82.25,43.03 82.25,33.79 81.51,33.05 78.1,33.05 v76.25,31.19 | v73.58,32.09 73.58,32.77 72.98,33.37 70.21,33.37 v66.66,29.83
SIGNAL_5
  Top 0.305: R10.2 75.38,27.71 OS5.E 76.22,27.71 81.19,32.67 81.18,32.67 82.3,33.79 82.3,33.91 86.64,38.24 86.64,40.11 86.27,40.48 U1.19
SIGNAL_6  (via drill 0.5)
  Top 0.152: v63.59,42.59 63.59,42.86 66.84,46.11 66.84,46.98 67.05,47.2 67.05,50.44 68.88,52.27 81.53,52.27 85.65,48.15 85.65,43.28 85.34,42.97 84.73,42.97 U1.22
  Top 0.508: OS6.E 51.24,21.64 R8.2
  Bottom 0.152: OS6.E 51.05,21.48 50.14,20.57 48.16,20.57 43.89,24.84 43.13,24.84 42.06,25.9 42.06,30.28 42.58,30.8 42.58,31.61 42.06,32.13 42.06,34.71 43.32,35.96 43.89,35.96 44.02,36.09 44.43,36.09 51.56,43.22 58.55,43.22 59.18,42.58 63.58,42.58 v63.59,42.59
SS  (via drill 0.5)
  Top 0.305: U1.14 81.57,36.3 v81.24,35.97
  Bottom 0.305: JP2.4 62.22,26.1 60.98,24.86 58.83,24.86 57.56,26.13 57.56,29.34 58.04,29.82 58.04,30.08 59.1,31.13 60.92,31.13 61.07,31.29 61.88,31.29 62.57,31.98 62.55,32.02 62.69,32.54 62.69,32.72 63.15,33.18 63.77,33.18 66.26,35.67 75.38,35.67 75.92,36.21 80.01,36.21 80.02,36.21 81,36.21 v81.24,35.97
TX  (via drill 0.5)
  Top 0.305: JP2.8 60.75,22.54 59.24,22.54 59,22.78 58.74,22.78 58.74,23.04 58.61,23.16 58.61,29.13 58.74,29.26 58.74,29.71 59.07,30.04 63.26,30.04 63.26,31.02 62.95,31.33 62.54,32.04 62.83,33.12 63.26,33.55 63.26,34.6 v63.37,34.72 | v78.59,43.42 78.59,45.2 78.58,45.21 78.58,45.75 U1.31
  Bottom 0.305: v63.37,34.72 64.68,36.03 65.32,36.03 65.76,36.47 65.76,36.59 75,36.59 78.59,40.18 v78.59,43.42

### Text on the board
tNames: Jakub Gal | 2020
bNames: Jakub Gal | 2020